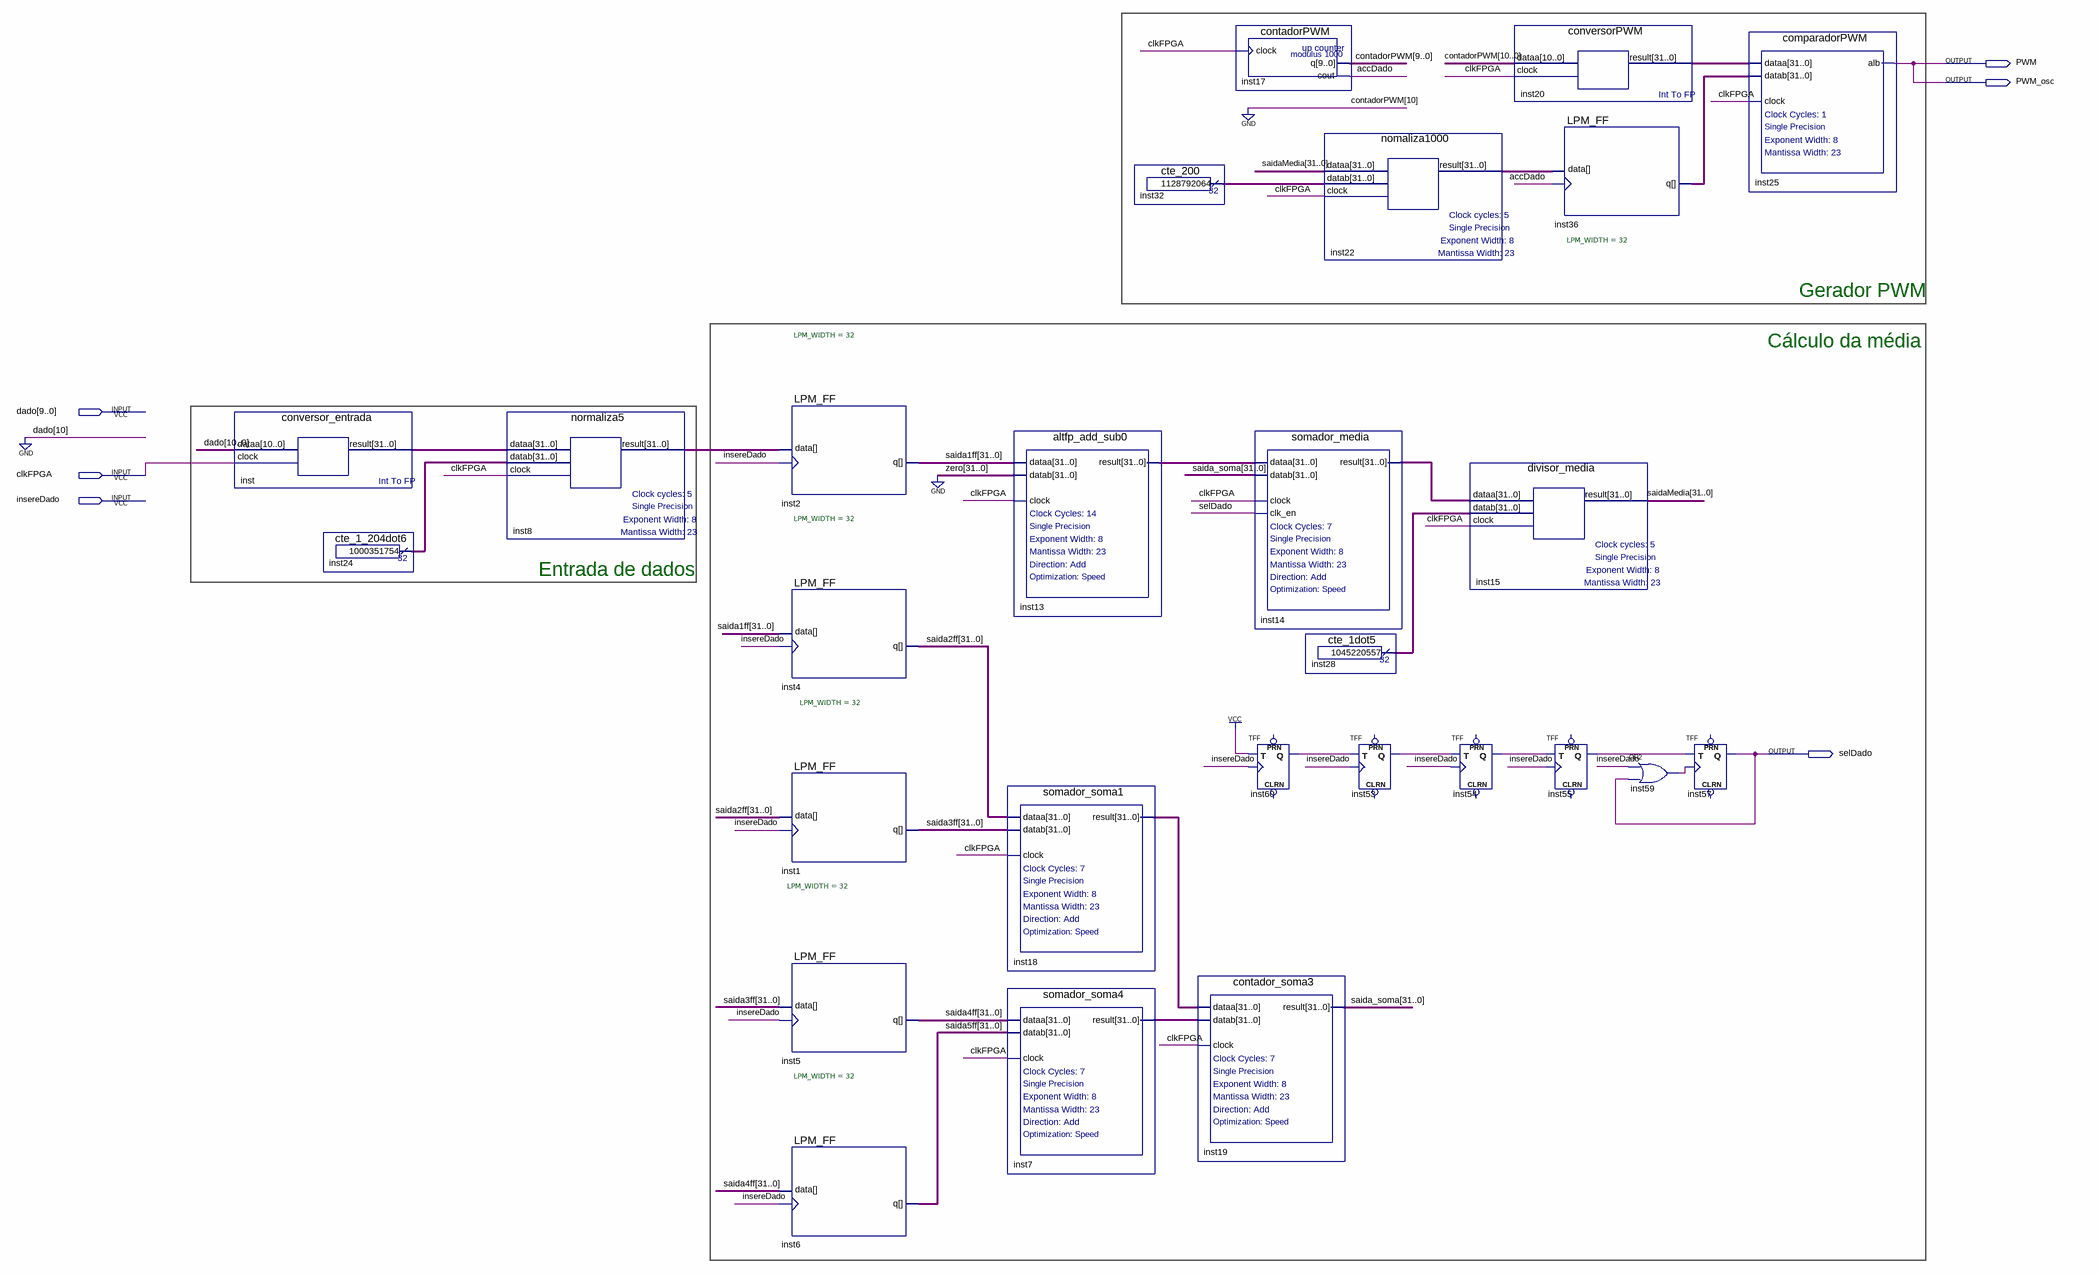
[diagram p0: schematic sheet]
// Quartus schematic media_movel2.bdf as structural Verilog: 27 symbols, 6 pins
module media_movel2 (
  input  [9:0] dado,
  input  clkFPGA,
  input  insereDado,
  output PWM,
  output PWM_osc,
  output selDado
);

  wire accDado, inst53_q, inst54_q, inst55_q, inst59_out, inst60_q;
  wire [9:0] contadorPWM;
  wire [31:0] inst7_result, inst8_result, inst13_result, inst14_result, inst18_result, inst20_result,
       inst22_result, inst24_result, inst28_result, inst32_result, inst36_q, inst_result, saida1ff, saida2ff,
       saida3ff, saida4ff, saida5ff, saida_soma, saidaMedia;

  conversor_entrada inst (.dataa({1'b0, dado}), .clock(clkFPGA), .result(inst_result));
  cte_1_204dot6 inst24 (.result(inst24_result));
  normaliza5 inst8 (.dataa(inst_result), .datab(inst24_result), .clock(clkFPGA), .result(inst8_result));
  LPM_FF #(.LPM_WIDTH(32)) inst2 (.clock(insereDado), .data(inst8_result), .q(saida1ff));
  LPM_FF #(.LPM_WIDTH(32)) inst4 (.clock(insereDado), .data(saida1ff), .q(saida2ff));
  LPM_FF #(.LPM_WIDTH(32)) inst1 (.clock(insereDado), .data(saida2ff), .q(saida3ff));
  LPM_FF #(.LPM_WIDTH(32)) inst5 (.clock(insereDado), .data(saida3ff), .q(saida4ff));
  LPM_FF #(.LPM_WIDTH(32)) inst6 (.clock(insereDado), .data(saida4ff), .q(saida5ff));
  altfp_add_sub0 inst13 (.dataa(saida1ff), .datab({32{1'b0}}), .clock(clkFPGA), .result(inst13_result));
  somador_soma1 inst18 (.dataa(saida2ff), .datab(saida3ff), .clock(clkFPGA), .result(inst18_result));
  somador_soma4 inst7 (.dataa(saida4ff), .datab(saida5ff), .clock(clkFPGA), .result(inst7_result));
  cte_200 inst32 (.result(inst32_result));
  contador_soma3 inst19 (.dataa(inst18_result), .datab(inst7_result), .clock(clkFPGA), .result(saida_soma));
  contadorPWM inst17 (.clock(clkFPGA), .cout(accDado), .q(contadorPWM));
  TFF inst60 (.T(1'b1), .CLK(insereDado), .Q(inst60_q));  // open: PRN, CLRN
  somador_media inst14 (
    .dataa(inst13_result), .datab(saida_soma), .clock(clkFPGA), .clk_en(selDado), .result(inst14_result));
  nomaliza1000 inst22 (.dataa(saidaMedia), .datab(inst32_result), .clock(clkFPGA), .result(inst22_result));
  cte_1dot5 inst28 (.result(inst28_result));
  TFF inst53 (.T(inst60_q), .CLK(insereDado), .Q(inst53_q));  // open: PRN, CLRN
  TFF inst54 (.T(inst53_q), .CLK(insereDado), .Q(inst54_q));  // open: PRN, CLRN
  divisor_media inst15 (.dataa(inst14_result), .datab(inst28_result), .clock(clkFPGA), .result(saidaMedia));
  conversorPWM inst20 (.dataa({1'b0, contadorPWM}), .clock(clkFPGA), .result(inst20_result));
  LPM_FF #(.LPM_WIDTH(32)) inst36 (.clock(accDado), .data(inst22_result), .q(inst36_q));
  TFF inst55 (.T(inst54_q), .CLK(insereDado), .Q(inst55_q));  // open: PRN, CLRN
  or inst59 (inst59_out, insereDado, selDado);
  TFF inst57 (.T(inst55_q), .CLK(inst59_out), .Q(selDado));  // open: PRN, CLRN
  comparadorPWM inst25 (.dataa(inst20_result), .datab(inst36_q), .clock(clkFPGA), .alb(PWM));

  assign PWM_osc = PWM;

  // Notes on the sheet:
  //   Gerador PWM
  //   Cálculo da média
  //   Entrada de dados
endmodule
